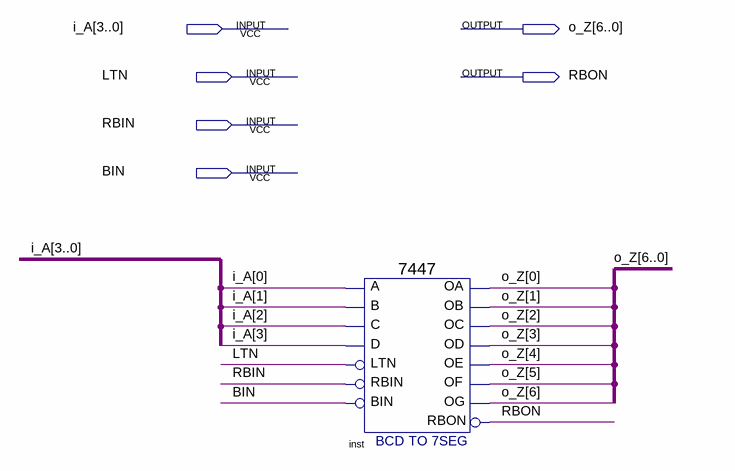
[diagram p0: schematic sheet]
// Quartus schematic ttl7447.bdf as structural Verilog: 1 symbols, 6 pins
module ttl7447 (
  input  [3:0] i_A,
  input  LTN,
  input  RBIN,
  input  BIN,
  output [6:0] o_Z,
  output RBON
);

  \7447  inst (
    .LTN(LTN), .B(i_A[1]), .C(i_A[2]), .D(i_A[3]), .RBIN(RBIN), .BIN(BIN), .A(i_A[0]), .OB(o_Z[1]),
    .OC(o_Z[2]), .OE(o_Z[4]), .OD(o_Z[3]), .OF(o_Z[5]), .OG(o_Z[6]), .OA(o_Z[0]), .RBON(RBON));
endmodule
